# EAGLE schematic kegboard (EAGLE 5.08)
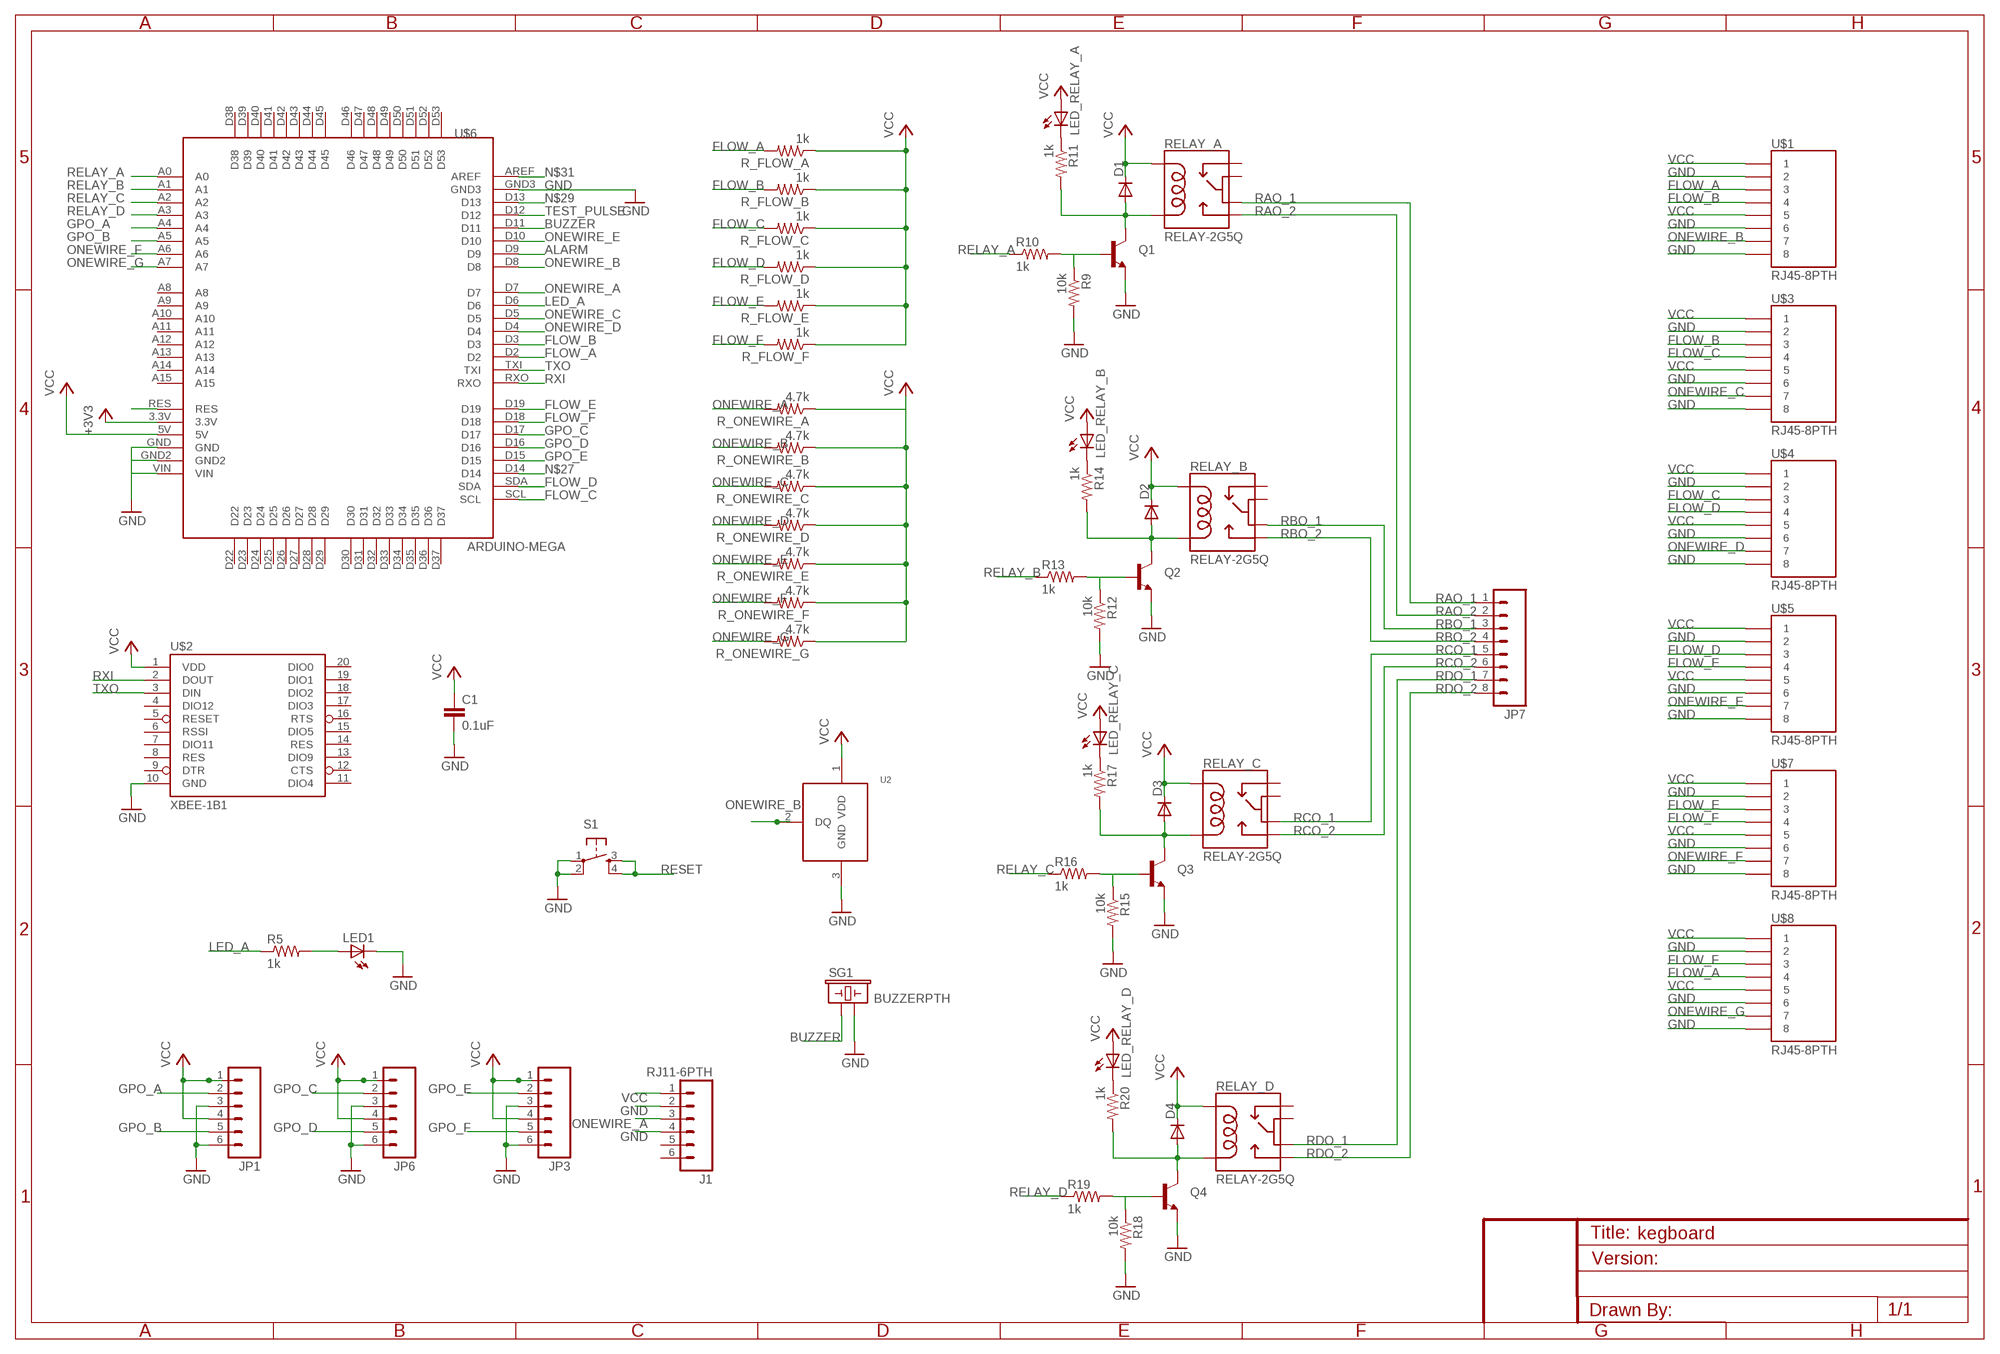
[diagram p0: schematic, sheet 1]

## Parts
C1  0.1uF  CAPPTH2  [CAP-PTH-SMALL2]
D1  DIODE1N4148  [DIODE-1N4148]
D2  DIODE1N4148  [DIODE-1N4148]
D3  DIODE1N4148  [DIODE-1N4148]
D4  DIODE1N4148  [DIODE-1N4148]
J1  RJ11-6PTH  [RJ11-6]
JP1  M063.5MM-6  [SCREWTERMINAL-3.5MM-6]
JP3  M063.5MM-6  [SCREWTERMINAL-3.5MM-6]
JP6  M063.5MM-6  [SCREWTERMINAL-3.5MM-6]
JP7  M083.5MM-8  [SCREWTERMINAL-3.5MM-8]
LED1  LED3MM  [LED3MM]
LED_RELAY_A  LED3MM  [LED3MM]
LED_RELAY_B  LED3MM  [LED3MM]
LED_RELAY_C  LED3MM  [LED3MM]
LED_RELAY_D  LED3MM  [LED3MM]
Q1  TRANSISTOR_NPNTO92  [TO-92]
Q2  TRANSISTOR_NPNTO92  [TO-92]
Q3  TRANSISTOR_NPNTO92  [TO-92]
Q4  TRANSISTOR_NPNTO92  [TO-92]
R5  1k  RESISTORPTH1  [AXIAL-0.3]
R9  10k  RESISTORPTH1  [AXIAL-0.3]
R10  1k  RESISTORPTH1  [AXIAL-0.3]
R11  1k  RESISTORPTH1  [AXIAL-0.3]
R12  10k  RESISTORPTH1  [AXIAL-0.3]
R13  1k  RESISTORPTH1  [AXIAL-0.3]
R14  1k  RESISTORPTH1  [AXIAL-0.3]
R15  10k  RESISTORPTH1  [AXIAL-0.3]
R16  1k  RESISTORPTH1  [AXIAL-0.3]
R17  1k  RESISTORPTH1  [AXIAL-0.3]
R18  10k  RESISTORPTH1  [AXIAL-0.3]
R19  1k  RESISTORPTH1  [AXIAL-0.3]
R20  1k  RESISTORPTH1  [AXIAL-0.3]
R_FLOW_A  1k  RESISTORPTH1  [AXIAL-0.3]
R_FLOW_B  1k  RESISTORPTH1  [AXIAL-0.3]
R_FLOW_C  1k  RESISTORPTH1  [AXIAL-0.3]
R_FLOW_D  1k  RESISTORPTH1  [AXIAL-0.3]
R_FLOW_E  1k  RESISTORPTH1  [AXIAL-0.3]
R_FLOW_F  1k  RESISTORPTH1  [AXIAL-0.3]
R_ONEWIRE_A  4.7k  RESISTORPTH1  [AXIAL-0.3]
R_ONEWIRE_B  4.7k  RESISTORPTH1  [AXIAL-0.3]
R_ONEWIRE_C  4.7k  RESISTORPTH1  [AXIAL-0.3]
R_ONEWIRE_D  4.7k  RESISTORPTH1  [AXIAL-0.3]
R_ONEWIRE_E  4.7k  RESISTORPTH1  [AXIAL-0.3]
R_ONEWIRE_F  4.7k  RESISTORPTH1  [AXIAL-0.3]
R_ONEWIRE_G  4.7k  RESISTORPTH1  [AXIAL-0.3]
RELAY_A  RELAY-2G5Q  [RELAY-G5V]
RELAY_B  RELAY-2G5Q  [RELAY-G5V]
RELAY_C  RELAY-2G5Q  [RELAY-G5V]
RELAY_D  RELAY-2G5Q  [RELAY-G5V]
S1  TAC_SWITCHPTH  [TACTILE-PTH]
SG1  BUZZERPTH  [BUZZER-12MM]
U2  18S20  [TO-92]
U$1  RJ45-8PTH  [RJ45-8]
U$2  XBEE-1B1  [XBEE-1]
U$3  RJ45-8PTH  [RJ45-8]
U$4  RJ45-8PTH  [RJ45-8]
U$5  RJ45-8PTH  [RJ45-8]
U$6  ARDUINO-MEGA  [ARDUINO-MEGA]
U$7  RJ45-8PTH  [RJ45-8]
U$8  RJ45-8PTH  [RJ45-8]

## Nets
+3V3: U$6.3.3V
ALARM: U$6.D9
BUZZER: SG1.+ U$6.D11
FLOW_A: R_FLOW_A.P$2 U$1.3 U$6.D2 U$8.4
FLOW_B: R_FLOW_B.P$2 U$1.4 U$3.3 U$6.D3
FLOW_C: R_FLOW_C.P$2 U$3.4 U$4.3 U$6.SCL
FLOW_D: R_FLOW_D.P$2 U$4.4 U$5.3 U$6.SDA
FLOW_E: R_FLOW_E.P$2 U$5.4 U$6.D19 U$7.3
FLOW_F: R_FLOW_F.P$2 U$6.D18 U$7.4 U$8.3
GND: C1.2 J1.2 J1.4 JP1.3 JP1.6 JP3.3 JP3.6 JP6.3 JP6.6 LED1.K(C) Q1.1(E) Q2.1(E) Q3.1(E) Q4.1(E) R9.P$2 R12.P$2 R15.P$2 R18.P$2 S1.1 S1.2 SG1.- U2.3(GND) U$1.2 U$1.6 U$1.8 U$2.10(GND) U$3.2 U$3.6 U$3.8 U$4.2 U$4.6 U$4.8 U$5.2 U$5.6 U$5.8 U$6.GND U$6.GND2 U$6.GND3 U$6.VIN U$7.2 U$7.6 U$7.8 U$8.2 U$8.6 U$8.8
GPO_A: JP1.2 U$6.A4
GPO_B: JP1.5 U$6.A5
GPO_C: JP6.2 U$6.D17
GPO_D: JP6.5 U$6.D16
GPO_E: JP3.2 U$6.D15
GPO_F: JP3.5
LED_A: R5.P$1 U$6.D6
N$1: LED1.A R5.P$2
N$7: D1.A Q1.3(C) R11.P$2 RELAY_A.9
N$8: Q1.2(B) R9.P$1 R10.P$2
N$10: LED_RELAY_A.K(C) R11.P$1
N$12: D2.A Q2.3(C) R14.P$2 RELAY_B.9
N$13: Q2.2(B) R12.P$1 R13.P$2
N$14: LED_RELAY_B.K(C) R14.P$1
N$17: D3.A Q3.3(C) R17.P$2 RELAY_C.9
N$18: Q3.2(B) R15.P$1 R16.P$2
N$19: LED_RELAY_C.K(C) R17.P$1
N$22: D4.A Q4.3(C) R20.P$2 RELAY_D.9
N$23: Q4.2(B) R18.P$1 R19.P$2
N$24: LED_RELAY_D.K(C) R20.P$1
N$25: R_ONEWIRE_A.P$1 R_ONEWIRE_B.P$1 R_ONEWIRE_C.P$1 R_ONEWIRE_D.P$1 R_ONEWIRE_E.P$1 R_ONEWIRE_F.P$1 R_ONEWIRE_G.P$1
N$27: U$6.D14
N$29: U$6.D13
N$31: U$6.AREF
N$37: U$6.RES
ONEWIRE_A: J1.3 R_ONEWIRE_A.P$2 U$6.D7
ONEWIRE_B: R_ONEWIRE_B.P$2 U2.2(DQ) U$1.7 U$6.D8
ONEWIRE_C: R_ONEWIRE_C.P$2 U$3.7 U$6.D5
ONEWIRE_D: R_ONEWIRE_D.P$2 U$4.7 U$6.D4
ONEWIRE_E: R_ONEWIRE_E.P$2 U$5.7 U$6.D10
ONEWIRE_F: R_ONEWIRE_F.P$2 U$6.A6 U$7.7
ONEWIRE_G: R_ONEWIRE_G.P$2 U$6.A7 U$8.7
RAO_1: JP7.1 RELAY_A.6
RAO_2: JP7.2 RELAY_A.10
RBO_1: JP7.3 RELAY_B.6
RBO_2: JP7.4 RELAY_B.10
RCO_1: JP7.5 RELAY_C.6
RCO_2: JP7.6 RELAY_C.10
RDO_1: JP7.7 RELAY_D.6
RDO_2: JP7.8 RELAY_D.10
RELAY_A: R10.P$1 U$6.A0
RELAY_B: R13.P$1 U$6.A1
RELAY_C: R16.P$1 U$6.A2
RELAY_D: R19.P$1 U$6.A3
RESET: S1.3 S1.4
RXI: U$2.2(DOUT) U$6.RXO
TEST_PULSE: U$6.D12
TXO: U$2.3(DIN) U$6.TXI
VCC: C1.1 D1.C D2.C D3.C D4.C J1.1 JP1.1 JP1.4 JP3.1 JP3.4 JP6.1 JP6.4 LED_RELAY_A.A LED_RELAY_B.A LED_RELAY_C.A LED_RELAY_D.A R_FLOW_A.P$1 R_FLOW_B.P$1 R_FLOW_C.P$1 R_FLOW_D.P$1 R_FLOW_E.P$1 R_FLOW_F.P$1 RELAY_A.2 RELAY_B.2 RELAY_C.2 RELAY_D.2 U2.1(VDD) U$1.1 U$1.5 U$2.1(VDD) U$3.1 U$3.5 U$4.1 U$4.5 U$5.1 U$5.5 U$6.5V U$7.1 U$7.5 U$8.1 U$8.5
Unconnected: J1.5 J1.6 RELAY_A.1 RELAY_A.5 RELAY_B.1 RELAY_B.5 RELAY_C.1 RELAY_C.5 RELAY_D.1 RELAY_D.5 U$2.4(DIO12) U$2.5(RESET) U$2.6(RSSI) U$2.7(DIO11) U$2.8(RES) U$2.9(DTR) U$2.11(DIO4) U$2.12(CTS) U$2.13(DIO9) U$2.14(RES) U$2.15(DIO5) U$2.16(RTS) U$2.17(DIO3) U$2.18(DIO2) U$2.19(DIO1) U$2.20(DIO0) U$6.A8 U$6.A9 U$6.A10 U$6.A11 U$6.A12 U$6.A13 U$6.A14 U$6.A15 U$6.D22 U$6.D23 U$6.D24 U$6.D25 U$6.D26 U$6.D27 U$6.D28 U$6.D29 U$6.D30 U$6.D31 U$6.D32 U$6.D33 U$6.D34 U$6.D35 U$6.D36 U$6.D37 U$6.D38 U$6.D39 U$6.D40 U$6.D41 U$6.D42 U$6.D43 U$6.D44 U$6.D45 U$6.D46 U$6.D47 U$6.D48 U$6.D49 U$6.D50 U$6.D51 U$6.D52 U$6.D53

## Library data of the parts
C1 = SparkFun:CAP: Capacitor Standard 0603 ceramic capacitor, and 0.1" leaded capacitor.
D1-D4 = SparkFun:DIODE: Diode These are standard reverse protection diodes and small signal diodes. SMA package can handle up to about 1A. SOD-323 can handle about 200mA. What the SOD-323 package when ordering, there are some mfgs out there that are 5-pin packages.
J1 = SparkFun:RJ11-6: RJ11 Jack Simple 6 pin RJ11 jack. Commonly found on CAT3 devices and Microchip programmers. SKU: PRT-00132
JP1 JP3 JP6 = SparkFun-20100412:M06: Header 6 Standard 6-pin 0.1" header. Use with straight break away headers (SKU : PRT-00116), right angle break away headers (PRT-00553), swiss pins (PRT-00743), machine pins (PRT-00117), and female headers (PRT-00115). Molex polarized connector foot print use with SKU : PRT-08094 with associated crimp pins and housings. NOTES ON THE VARIANTS LOCK and LOCK_LONGPADS... This footprint was designed to help hold the alignment of a through-hole component (i.e. 6-pin header) while soldering it into place. You may notice that each hole has been shifted either up or down by 0.005 of an inch from it's more standard position (which is a perfectly straight line). This slight alteration caused the pins (the squares in the middle) to touch the edges of the holes. Because they are alternating, it causes a "brace" to hold the component in place. 0.005 has proven to be the perfect amount of "off-center" position when using our standard breakaway headers. Although looks a little odd when you look at the bare footprint, once you have a header in there, the alteration is very hard to notice. Also, if you push a header all the way into place, it is covered up entirely on the bottom side. This idea of altering the position of holes to aid alignment will be further integrated into the Sparkfun Library for other footprints. It can help hold any component with 3 or more connection pins.
JP7 = SparkFun-20100412:M08: Header 8 Standard 8-pin 0.1" header. Use with straight break away headers (SKU : PRT-00116), right angle break away headers (PRT-00553), swiss pins (PRT-00743), machine pins (PRT-00117), and female headers (PRT-00115).
LED1 LED_RELAY_A LED_RELAY_B LED_RELAY_C LED_RELAY_D = led:LED: LED OSRAM: - CHIPLED LG R971, LG N971, LY N971, LG Q971, LY Q971, LO R971, LY R971 LH N974, LH R974 LS Q976, LO Q976, LY Q976 LO Q996 - Hyper CHIPLED LW Q18S LB Q993, LB Q99A, LB R99A - SideLED LS A670, LO A670, LY A670, LG A670, LP A670 LB A673, LV A673, LT A673, LW A673 LH A674 LY A675 LS A676, LA A676, LO A676, LY A676, LW A676 LS A679, LY A679, LG A679 - Hyper Micro SIDELED® LS Y876, LA Y876, LO Y876, LY Y876 LT Y87S - SmartLED LW L88C, LW L88S LB L89C, LB L89S, LG L890 LS L89K, LO L89K, LY L89K LS L896, LA L896, LO L896, LY L896 - TOPLED LS T670, LO T670, LY T670, LG T670, LP T670 LSG T670, LSP T670, LSY T670, LOP T670, LYG T670 LG T671, LOG T671, LSG T671 LB T673, LV T673, LT T673, LW T673 LH T674 LS T676, LA T676, LO T676, LY T676, LB T676, LH T676, LSB T676, LW T676 LB T67C, LV T67C, LT T67C, LS T67K, LO T67K, LY T67K, LW E67C LS E67B, LA E67B, LO E67B, LY E67B, LB E67C, LV E67C, LT E67C LW T67C LS T679, LY T679, LG T679 LS T770, LO T770, LY T770, LG T770, LP T770 LB T773, LV T773, LT T773, LW T773 LH T774 LS E675, LA E675, LY E675, LS T675 LS T776, LA T776, LO T776, LY T776, LB T776 LHGB T686 LT T68C, LB T68C - Hyper Mini TOPLED® LB M676 - Mini TOPLED Santana® LG M470 LS M47K, LO M47K, LY M47K Source: http://www.osram.convergy.de LUXEON: - LUMILED® LXK2-PW12-R00, LXK2-PW12-S00, LXK2-PW14-U00, LXK2-PW14-V00 LXK2-PM12-R00, LXK2-PM12-S00, LXK2-PM14-U00 LXK2-PE12-Q00, LXK2-PE12-R00, LXK2-PE12-S00, LXK2-PE14-T00, LXK2-PE14-U00 LXK2-PB12-K00, LXK2-PB12-L00, LXK2-PB12-M00, LXK2-PB14-N00, LXK2-PB14-P00, LXK2-PB14-Q00 LXK2-PR12-L00, LXK2-PR12-M00, LXK2-PR14-Q00, LXK2-PR14-R00 LXK2-PD12-Q00, LXK2-PD12-R00, LXK2-PD12-S00 LXK2-PH12-R00, LXK2-PH12-S00 LXK2-PL12-P00, LXK2-PL12-Q00, LXK2-PL12-R00 Source: www.luxeon.com KINGBRIGHT: KA-3528ASYC Source: www.kingbright.com
Q1-Q4 = SparkFun:TRANSISTOR_NPN: Transistor NPN BJT configuration in SOT23 package. MMBT2222 is the common NPN we use. Double check BCE configuration again layout.
R5 R9-R20 R_FLOW_A R_FLOW_B R_FLOW_C R_FLOW_D R_FLOW_E R_FLOW_F R_ONEWIRE_A R_ONEWIRE_B R_ONEWIRE_C R_ONEWIRE_D R_ONEWIRE_E R_ONEWIRE_F R_ONEWIRE_G = SparkFun:RESISTOR: Resistor Basic schematic elements and footprints for 0603, 1206, and PTH 1/10th watt (small) resistors.
RELAY_A RELAY_B RELAY_C RELAY_D = SparkFun:RELAY-2
S1 = SparkFun:TAC_SWITCH: Momentary Switch Button commonly used for reset or general input. Spark Fun Electronics SKU : COM-00097
SG1 = SparkFun:BUZZER: Buzzer 12mm Spark Fun Electronics SKU : Comp-Buzzer
U2 = merriman:18S20: Dallas/Maxim 18S20 1-Wire temperature sensor (including PAR, since assumes pin 3 NOT connected internally on that variant)
U$1 U$3-U$5 U$7 U$8 = SparkFun:RJ45-8: RJ45 Jack Simple RJ45, 8-pin connection - connector for common Cat5, Cat5e, and Cat6 Ethernet cables. Footprint not yet proven in production. Connector sku is PRT-00643; Breakout PCB sku is BOB-00716.
U$2 = SparkFun:XBEE-1
U$6 = arduino-mega:ARDUINO-MEGA